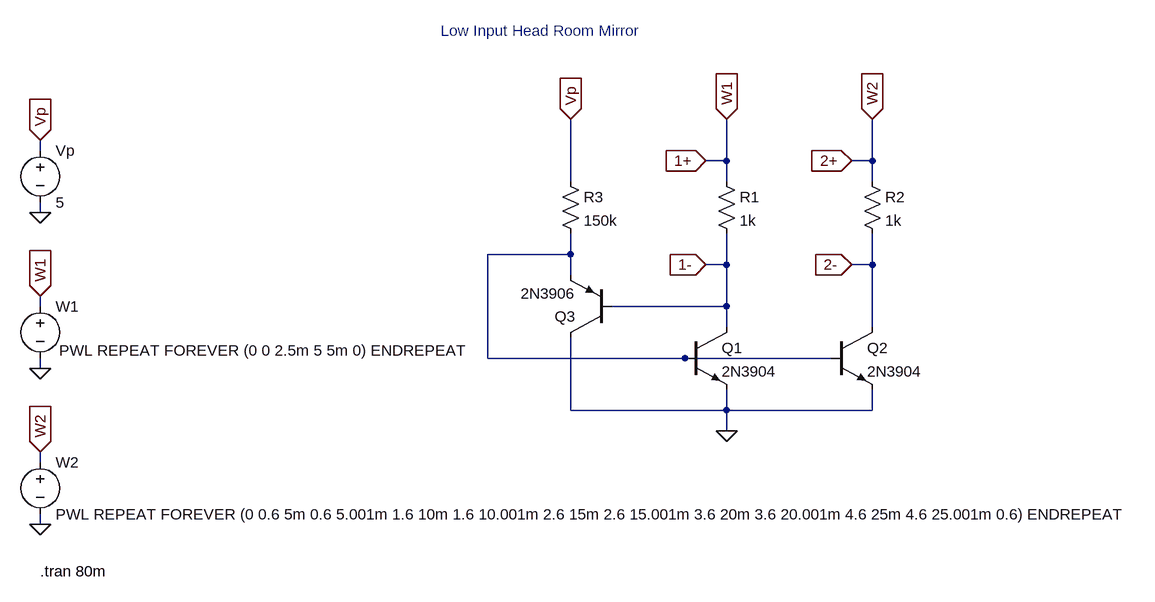
[diagram p0: schematic low_input_head_room.asc]
low_input_head_room.asc, the LTspice schematic file:
Version 4
SHEET 1 2016 1044
WIRE -1536 -16 -1536 -32
WIRE -480 0 -480 -64
WIRE -480 0 -512 0
WIRE -256 0 -256 -64
WIRE -256 0 -288 0
WIRE -720 32 -720 -64
WIRE -480 32 -480 0
WIRE -256 32 -256 0
WIRE -1536 80 -1536 64
WIRE -720 144 -720 112
WIRE -720 144 -848 144
WIRE -480 160 -480 112
WIRE -480 160 -512 160
WIRE -256 160 -256 112
WIRE -256 160 -288 160
WIRE -720 176 -720 144
WIRE -1536 224 -1536 208
WIRE -480 224 -480 160
WIRE -480 224 -656 224
WIRE -480 256 -480 224
WIRE -256 256 -256 160
WIRE -848 304 -848 144
WIRE -544 304 -848 304
WIRE -320 304 -544 304
WIRE -1536 320 -1536 304
WIRE -720 384 -720 272
WIRE -480 384 -480 352
WIRE -480 384 -720 384
WIRE -256 384 -256 352
WIRE -256 384 -480 384
WIRE -480 416 -480 384
WIRE -1536 464 -1536 448
WIRE -1536 560 -1536 544
FLAG -1536 320 0
FLAG -1536 560 0
FLAG -1536 208 W1
IOPIN -1536 208 In
FLAG -1536 448 W2
IOPIN -1536 448 In
FLAG -1536 80 0
FLAG -1536 -32 Vp
IOPIN -1536 -32 In
FLAG -480 416 0
FLAG -720 -64 Vp
IOPIN -720 -64 In
FLAG -480 -64 W1
IOPIN -480 -64 In
FLAG -256 -64 W2
IOPIN -256 -64 In
FLAG -512 0 1+
IOPIN -512 0 In
FLAG -512 160 1-
IOPIN -512 160 In
FLAG -288 0 2+
IOPIN -288 0 In
FLAG -288 160 2-
IOPIN -288 160 In
SYMBOL voltage -1536 208 R0
WINDOW 3 29 84 Left 2
WINDOW 123 0 0 Left 0
WINDOW 39 0 0 Left 0
SYMATTR Value PWL REPEAT FOREVER (0 0 2.5m 5 5m 0) ENDREPEAT
SYMATTR InstName W1
SYMBOL voltage -1536 448 R0
WINDOW 123 0 0 Left 0
WINDOW 39 0 0 Left 0
SYMATTR InstName W2
SYMATTR Value PWL REPEAT FOREVER (0 0.6 5m 0.6 5.001m 1.6 10m 1.6 10.001m 2.6 15m 2.6 15.001m 3.6 20m 3.6 20.001m 4.6 25m 4.6 25.001m 0.6) ENDREPEAT
SYMBOL voltage -1536 -32 R0
SYMATTR InstName Vp
SYMATTR Value 5
SYMBOL res -496 16 R0
SYMATTR InstName R1
SYMATTR Value 1k
SYMBOL res -272 16 R0
SYMATTR InstName R2
SYMATTR Value 1k
SYMBOL res -736 16 R0
SYMATTR InstName R3
SYMATTR Value 150k
SYMBOL npn -544 256 R0
SYMATTR InstName Q1
SYMATTR Value 2N3904
SYMBOL npn -320 256 R0
SYMATTR InstName Q2
SYMATTR Value 2N3904
SYMBOL pnp -656 272 R180
SYMATTR InstName Q3
SYMATTR Value 2N3906
TEXT -920 -200 Left 2 ;Low Input Head Room Mirror
TEXT -1536 632 Left 2 !.tran 80m

The netlist it stands for:
* low_input_head_room.asc
V§W1 1+ 0 PWL REPEAT FOREVER (0 0 2.5m 5 5m 0) ENDREPEAT
V§W2 2+ 0 PWL REPEAT FOREVER (0 0.6 5m 0.6 5.001m 1.6 10m 1.6 10.001m 2.6 15m 2.6 15.001m 3.6 20m 3.6 20.001m 4.6 25m 4.6 25.001m 0.6) ENDREPEAT
Vp Vp 0 5
R1 1+ 1- 1k
R2 2+ 2- 1k
R3 Vp N001 150k
Q1 1- N001 0 0 2N3904
Q2 2- N001 0 0 2N3904
Q3 0 1- N001 0 2N3906
.model NPN NPN
.model PNP PNP
.lib standard.bjt
* Low Input Head Room Mirror
.tran 80m
.backanno
.end